# Altium schematic sheet addons_Hbridge,shiftReg.SchDoc
size A4; SheetNumber: 1; SheetTotal: 2
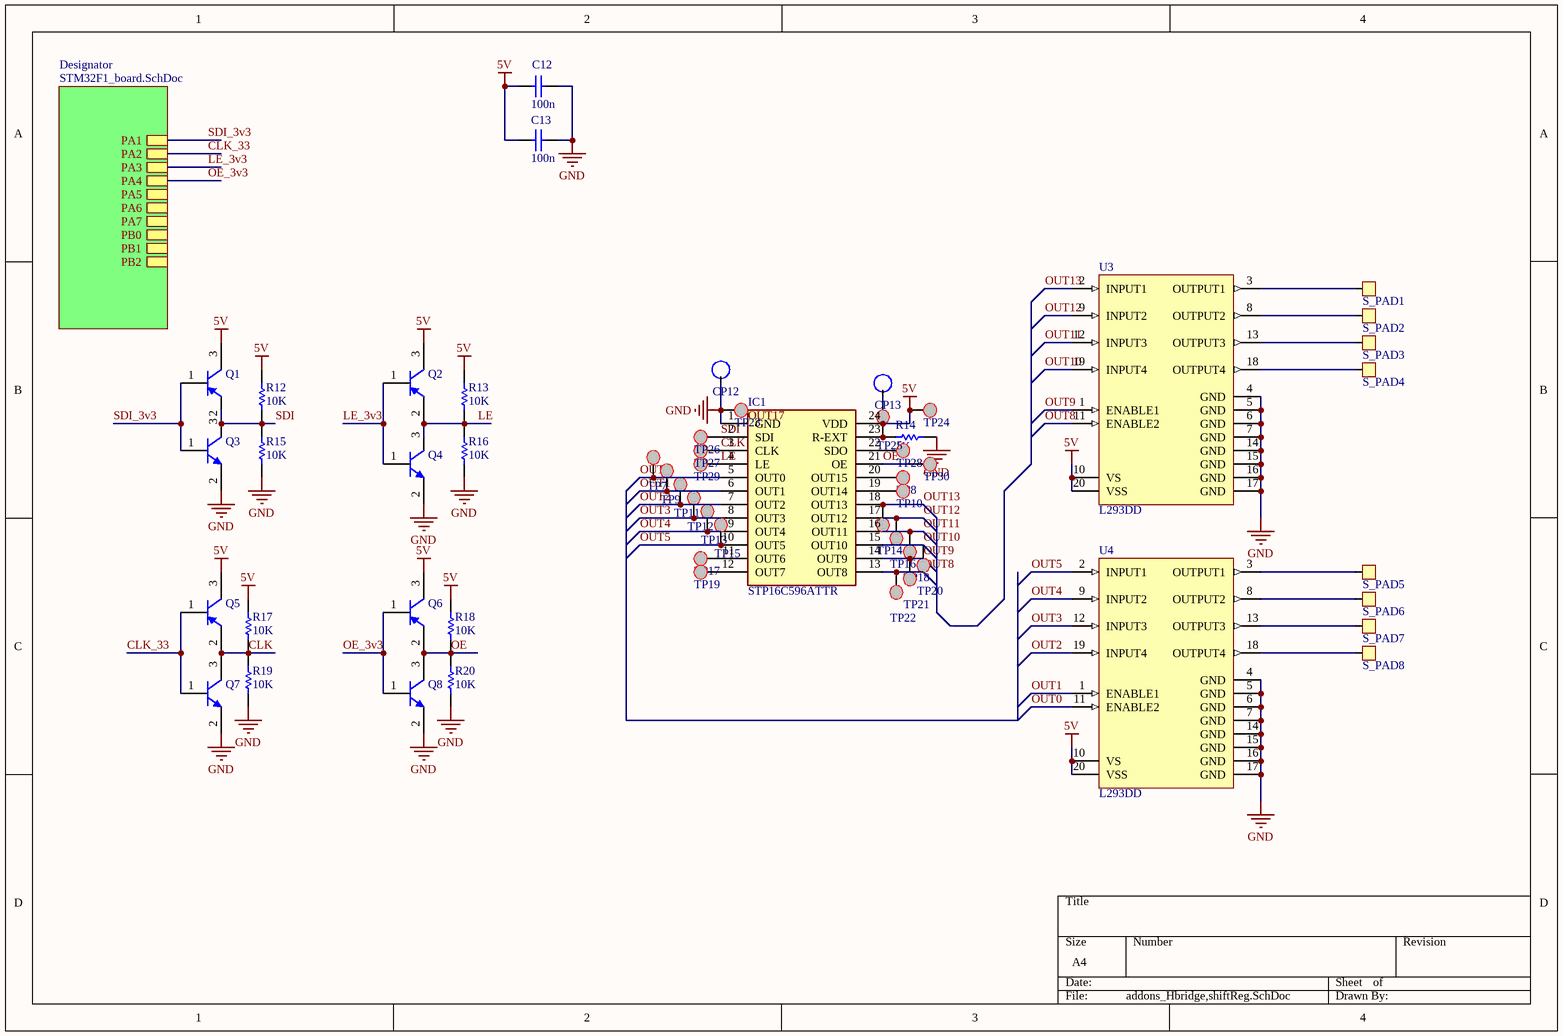
[diagram p0: addons_Hbridge,shiftReg.SchDoc]

## Parts
C12  value 100n  [SMD-0603-RES]  (hidden comment: Capacitor)
C13  value 100n  [SMD-0603-RES]  (hidden comment: Capacitor)
CP12  CONNECT_PAD  [PAD_SQUARE]  (value not drawn)
CP13  CONNECT_PAD  [PAD_SQUARE]  (value not drawn)
IC1  STP16C596ATTR  [SOP65P638X110-24N]
Q1  BC807-40LT1G  [ONSC-SOT-23-3-318-08_V]  (value not drawn)
Q2  BC807-40LT1G  [ONSC-SOT-23-3-318-08_V]  (value not drawn)
Q3  MMBTA42LT1G  [ONSC-SOT-23-3-318-08_V]  (value not drawn)
Q4  MMBTA42LT1G  [ONSC-SOT-23-3-318-08_V]  (value not drawn)
Q5  BC807-40LT1G  [ONSC-SOT-23-3-318-08_V]  (value not drawn)
Q6  BC807-40LT1G  [ONSC-SOT-23-3-318-08_V]  (value not drawn)
Q7  MMBTA42LT1G  [ONSC-SOT-23-3-318-08_V]  (value not drawn)
Q8  MMBTA42LT1G  [ONSC-SOT-23-3-318-08_V]  (value not drawn)
R12  value 10K  [SMD-0603-RES]  (hidden comment: Resistor)
R13  value 10K  [SMD-0603-RES]  (hidden comment: Resistor)
R14  value 1K  [SMD-0603-RES]  (hidden comment: Resistor)
R15  value 10K  [SMD-0603-RES]  (hidden comment: Resistor)
R16  value 10K  [SMD-0603-RES]  (hidden comment: Resistor)
R17  value 10K  [SMD-0603-RES]  (hidden comment: Resistor)
R18  value 10K  [SMD-0603-RES]  (hidden comment: Resistor)
R19  value 10K  [SMD-0603-RES]  (hidden comment: Resistor)
R20  value 10K  [SMD-0603-RES]  (hidden comment: Resistor)
S_PAD1  SOLDER_PAD  [PAD_SQUARE]  (value not drawn)
S_PAD2  SOLDER_PAD  [PAD_SQUARE]  (value not drawn)
S_PAD3  SOLDER_PAD  [PAD_SQUARE]  (value not drawn)
S_PAD4  SOLDER_PAD  [PAD_SQUARE]  (value not drawn)
S_PAD5  SOLDER_PAD  [PAD_SQUARE]  (value not drawn)
S_PAD6  SOLDER_PAD  [PAD_SQUARE]  (value not drawn)
S_PAD7  SOLDER_PAD  [PAD_SQUARE]  (value not drawn)
S_PAD8  SOLDER_PAD  [PAD_SQUARE]  (value not drawn)
TP7  (no value)  [ROUND_SMALL]
TP8  (no value)  [ROUND_SMALL]
TP9  (no value)  [ROUND_SMALL]
TP10  (no value)  [ROUND_SMALL]
TP11  (no value)  [ROUND_SMALL]
TP12  (no value)  [ROUND_SMALL]
TP13  (no value)  [ROUND_SMALL]
TP14  (no value)  [ROUND_SMALL]
TP15  (no value)  [ROUND_SMALL]
TP16  (no value)  [ROUND_SMALL]
TP17  (no value)  [ROUND_SMALL]
TP18  (no value)  [ROUND_SMALL]
TP19  (no value)  [ROUND_SMALL]
TP20  (no value)  [ROUND_SMALL]
TP21  (no value)  [ROUND_SMALL]
TP22  (no value)  [ROUND_SMALL]
TP23  (no value)  [ROUND_SMALL]
TP24  (no value)  [ROUND_SMALL]
TP25  (no value)  [ROUND_SMALL]
TP26  (no value)  [ROUND_SMALL]
TP27  (no value)  [ROUND_SMALL]
TP28  (no value)  [ROUND_SMALL]
TP29  (no value)  [ROUND_SMALL]
TP30  (no value)  [ROUND_SMALL]
U3  L293DD  [STM-SOIC-20_M]
U4  L293DD  [STM-SOIC-20_M]

## Sub-sheets
Designator = STM32F1_board.SchDoc: PA1, PA2, PA3, PA4, PA5, PA6, PA7, PB0, PB1, PB2

## Nets
5V: C12.1 C13.1 CP13.1 IC1.24(VDD) Q1.3(C) Q2.3(C) Q5.3(C) Q6.3(C) R12.2 R13.2 R17.2 R18.2 TP24.1(Test_Point) U3.10(VS) U3.20(VSS) U4.10(VS) U4.20(VSS)
GND: C12.2 C13.2 CP12.1 IC1.1(GND) Q3.2(E) Q4.2(E) Q7.2(E) Q8.2(E) R14.2 R15.1 R16.1 R19.1 R20.1 TP23.1(Test_Point) U3.4(GND) U3.5(GND) U3.6(GND) U3.7(GND) U3.14(GND) U3.15(GND) U3.16(GND) U3.17(GND) U4.4(GND) U4.5(GND) U4.6(GND) U4.7(GND) U4.14(GND) U4.15(GND) U4.16(GND) U4.17(GND)
CLK: IC1.3(CLK) Q5.2(E) Q7.3(C) R17.1 R19.2 TP27.1(Test_Point)
CLK_33: Q5.1(B) Q7.1(B) ; sheet Designator/PA2
LE: IC1.4(LE) Q2.2(E) Q4.3(C) R13.1 R16.2 TP29.1(Test_Point)
LE_3v3: Q2.1(B) Q4.1(B) ; sheet Designator/PA3
OE: IC1.21(OE) Q6.2(E) Q8.3(C) R18.1 R20.2 TP30.1(Test_Point)
OE_3v3: Q6.1(B) Q8.1(B) ; sheet Designator/PA4
OUT0: IC1.5(OUT0) TP7.1(Test_Point) U4.11(ENABLE2)
OUT1: IC1.6(OUT1) TP9.1(Test_Point) U4.1(ENABLE1)
OUT2: IC1.7(OUT2) TP11.1(Test_Point) U4.19(INPUT4)
OUT3: IC1.8(OUT3) TP12.1(Test_Point) U4.12(INPUT3)
OUT4: IC1.9(OUT4) TP13.1(Test_Point) U4.9(INPUT2)
OUT5: IC1.10(OUT5) TP15.1(Test_Point) U4.2(INPUT1)
OUT8: IC1.13(OUT8) TP22.1(Test_Point) U3.11(ENABLE2)
OUT9: IC1.14(OUT9) TP21.1(Test_Point) U3.1(ENABLE1)
OUT10: IC1.15(OUT10) TP20.1(Test_Point) U3.19(INPUT4)
OUT11: IC1.16(OUT11) TP18.1(Test_Point) U3.12(INPUT3)
OUT12: IC1.17(OUT12) TP16.1(Test_Point) U3.9(INPUT2)
OUT13: IC1.18(OUT13) TP14.1(Test_Point) U3.2(INPUT1)
SDI: IC1.2(SDI) Q1.2(E) Q3.3(C) R12.1 R15.2 TP26.1(Test_Point)
SDI_3v3: Q1.1(B) Q3.1(B) ; sheet Designator/PA1
NetIC1_11: IC1.11(OUT6) TP17.1(Test_Point)
NetIC1_12: IC1.12(OUT7) TP19.1(Test_Point)
NetIC1_19: IC1.19(OUT14) TP10.1(Test_Point)
NetIC1_20: IC1.20(OUT15) TP8.1(Test_Point)
NetIC1_22: IC1.22(SDO) TP28.1(Test_Point)
NetIC1_23: IC1.23(R-EXT) R14.1 TP25.1(Test_Point)
NetS_PAD1_1: S_PAD1.1 U3.3(OUTPUT1)
NetS_PAD2_1: S_PAD2.1 U3.8(OUTPUT2)
NetS_PAD3_1: S_PAD3.1 U3.13(OUTPUT3)
NetS_PAD4_1: S_PAD4.1 U3.18(OUTPUT4)
NetS_PAD5_1: S_PAD5.1 U4.3(OUTPUT1)
NetS_PAD6_1: S_PAD6.1 U4.8(OUTPUT2)
NetS_PAD7_1: S_PAD7.1 U4.13(OUTPUT3)
NetS_PAD8_1: S_PAD8.1 U4.18(OUTPUT4)

## Notes on the sheet
- Labels drawn without touching a wire or pin: OUT17

## Library data of the parts
C12 C13 = Capacitor: SimulationGenericComponent: True
IC1 = STP16C596ATTR: Integrated Circuit; Manufacturer_Name: STMicroelectronics; Datasheet Link: https://www.st.com/resource/en/datasheet/cd00005085.pdf; Height: 1.1mm; Manufacturer_Part_Number: STP16C596ATTR; Mouser Part Number: N/A; Mouser Price/Stock: https://www.mouser.co.uk/ProductDetail/STMicroelectronics/STP16C596ATTR?qs=y2Ae8b0edtM6tyumk2sS7g%3D%3D
Q1 Q2 Q5 Q6 = CMP-1048-00745-1: General Purpose Transistor, PNP Silicon, 3-Pin SOT-23, Pb-Free, Tape and Reel; Manufacturer: On Semiconductor; fT Min (MHz): 100; IC Continuous (A): -0.5; Mounting Technology: Surface Mount; ComponentLink3URL: http://www.onsemi.cn/pub_link/Collateral/318-08.PDF; PartNumber: BC807-40LT1G; DatasheetVersion: Rev. 10; RoHS: TRUE; ComponentLink1URL: http://www.onsemi.com/; ComponentLink2URL: http://www.onsemi.com/pub_link/Collateral/BC807-16LT1-D.PDF; ComponentLink1Description: Manufacturer URL; ComponentLink3Description: Package Specification; PackageVersion: Rev. AP, 11/2009; PackageReference: SOT-23-3-318-08; PackageDescription: 3-Pin Small Outline Transistor, Body 2.92 x 1.3 mm, Pitch 0.95 mm; Packing: Tape and Reel; Polarity: PNP; ComponentLink2Description: Datasheet
Q3 Q4 Q7 Q8 = CMP-1048-00662-1: High Voltage Transistor, NPN Silicon, 3-Pin SOT-23, Pb-Free, Tape and Reel; Manufacturer: On Semiconductor; fT Min (MHz): 50; IC Continuous (A): 0.5; ComponentLink1URL: http://www.onsemi.com/; ComponentLink3URL: http://www.onsemi.cn/pub_link/Collateral/318-08.PDF; RoHS: TRUE; ComponentLink2Description: Datasheet; PartNumber: MMBTA42LT1G; Polarity: NPN; DatasheetVersion: Rev. 12; PackageReference: SOT-23-3-318-08; PackageDescription: 3-Pin Small Outline Transistor, Body 2.92 x 1.3 mm, Pitch 0.95 mm; ComponentLink3Description: Package Specification; ComponentLink1Description: Manufacturer URL; Packing: Tape and Reel; PackageVersion: Rev. AP, 11/2009; Mounting Technology: Surface Mount; ComponentLink2URL: http://www.onsemi.cn/pub_link/Collateral/MMBTA42LT1-D.PDF
R12-R20 = Resistor: TC1: 0; SimulationGenericComponent: True; TC2: 0
TP7-TP30 = TEST_PAD
U3 U4 = CMP-1771-00003-1: Push-Pull Four Channel Driver with Diodes, 4.5 to 36 V, 20-Pin SOIC, RoHS, Tube; Voltage Rating: 50 V; Power Rating: 100 mW; Case\Package: 0603; Resistance: 15 kohm; Tolerance: 1%; REACH SVHC: Unknown; Case Code (Imperial): 0603; ComponentLink2Description: Datasheet; ComponentLink2URL: http://www.st.com/content/ccc/resource/technical/document/datasheet/04/ac/22/f9/20/5d/43/a1/CD00000059.pdf/files/CD00000059.pdf/jcr:content/translations/en.CD00000059.pdf; Max Operating Temperature: 155 degC; Width: 0.8 mm; ComponentLink1URL: http://www.st.com/; ComponentLink1Description: Manufacturer URL; Length: 1.6 mm; Package Quantity: 5000; RoHSCompliant: true; Height: 0.45 mm; Mount: Surface Mount; PackageDescription: 20-Pin Small Outline Integrated Circuit, Body 12.8 x 7.5 mm, Pitch 1.27 mm; PackageReference: SOIC-20; Packaging: Tape and Reel; Min Operating Temperature: -55 degC; Case Code (Metric): 1608; DatasheetVersion: Jul-03